# Altium schematic sheet LIDO-HW.100.InputStage_1.SchDoc
size A3; SheetNumber: 7; SheetTotal: 17
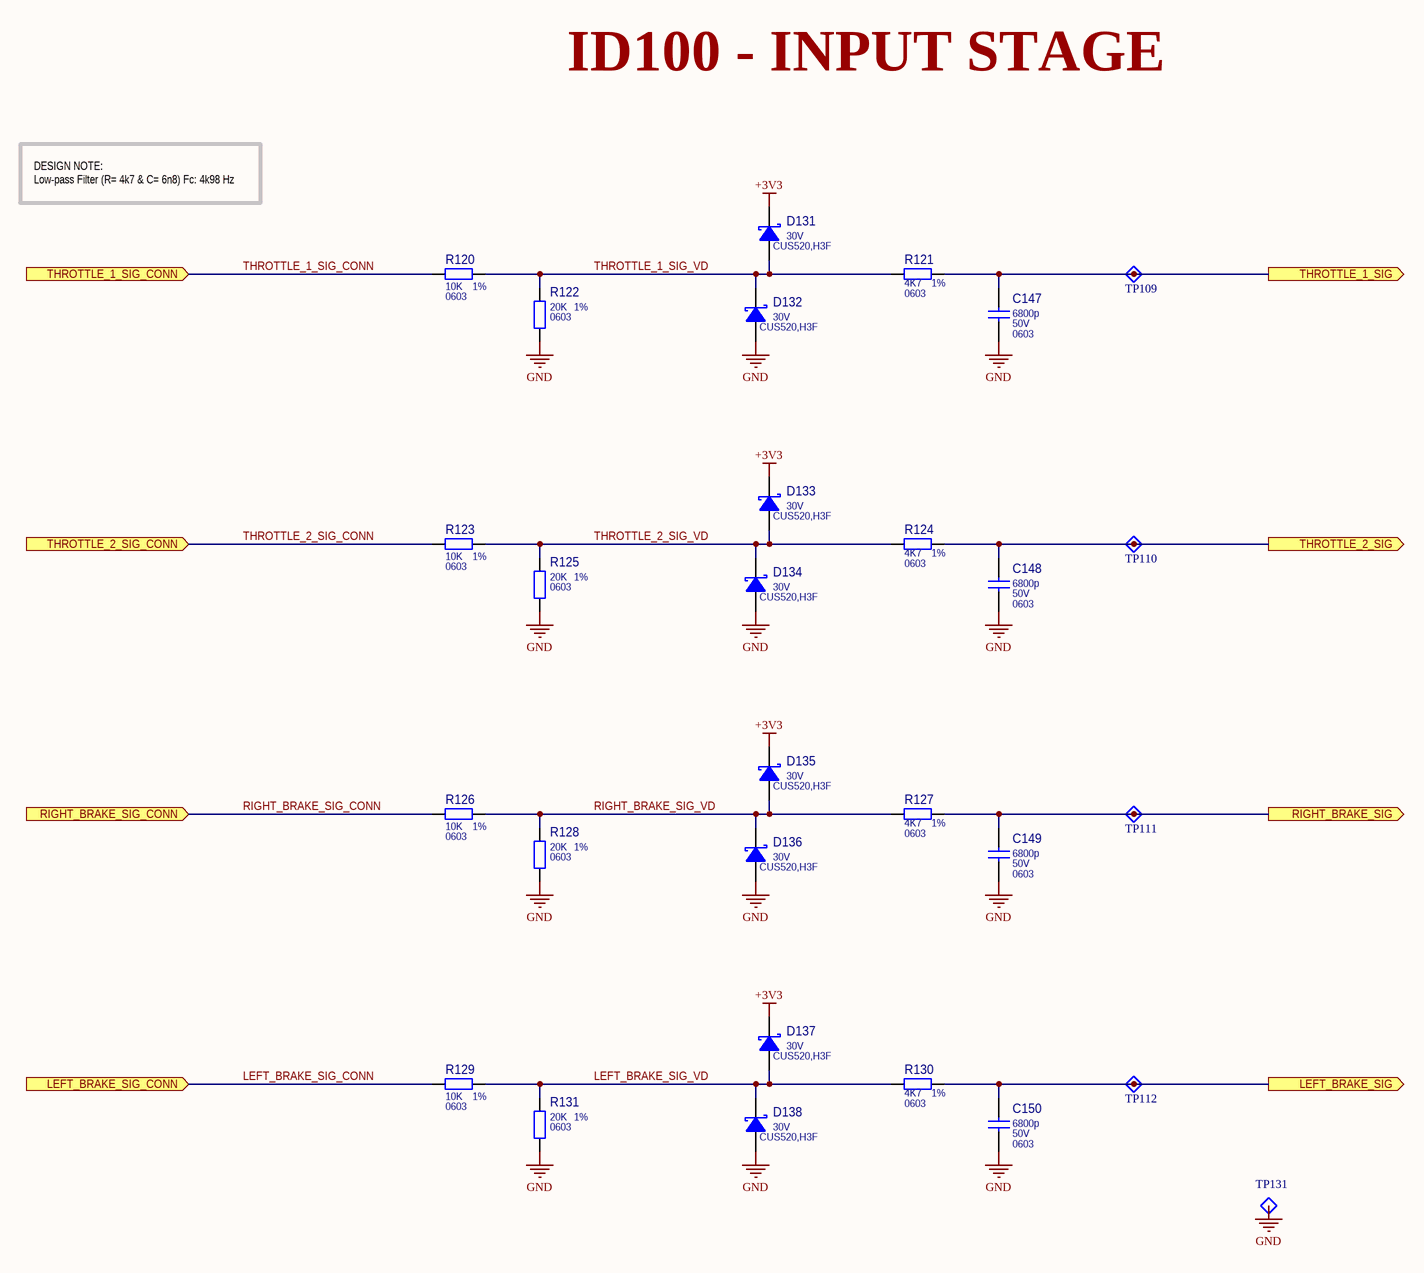
[diagram p0: LIDO-HW.100.InputStage_1.SchDoc]

## Parts
C147  6800p  Part Value 2: 50V  Part Package: 0603  [CAP_0603_1608X90-N_MURATA_A]
C148  6800p  Part Value 2: 50V  Part Package: 0603  [CAP_0603_1608X90-N_MURATA_A]
C149  6800p  Part Value 2: 50V  Part Package: 0603  [CAP_0603_1608X90-N_MURATA_A]
C150  6800p  Part Value 2: 50V  Part Package: 0603  [CAP_0603_1608X90-N_MURATA_A]
D131  30V  Manufacturer Part Number: CUS520,H3F  [NXP_SOD-323_250X125X95L30x32_A]
D132  30V  Manufacturer Part Number: CUS520,H3F  [NXP_SOD-323_250X125X95L30x32_A]
D133  30V  Manufacturer Part Number: CUS520,H3F  [NXP_SOD-323_250X125X95L30x32_A]
D134  30V  Manufacturer Part Number: CUS520,H3F  [NXP_SOD-323_250X125X95L30x32_A]
D135  30V  Manufacturer Part Number: CUS520,H3F  [NXP_SOD-323_250X125X95L30x32_A]
D136  30V  Manufacturer Part Number: CUS520,H3F  [NXP_SOD-323_250X125X95L30x32_A]
D137  30V  Manufacturer Part Number: CUS520,H3F  [NXP_SOD-323_250X125X95L30x32_A]
D138  30V  Manufacturer Part Number: CUS520,H3F  [NXP_SOD-323_250X125X95L30x32_A]
R120  10K  Part Value 2: 1%  Part Package: 0603  [RES_0603_1608X60-N_YAGEO_A]
R121  4K7  Part Value 2: 1%  Part Package: 0603  [RES_0603_1608X60-N_YAGEO_A]
R122  20K  Part Value 2: 1%  Part Package: 0603  [RES_0603_1608X60-N_YAGEO_A]
R123  10K  Part Value 2: 1%  Part Package: 0603  [RES_0603_1608X60-N_YAGEO_A]
R124  4K7  Part Value 2: 1%  Part Package: 0603  [RES_0603_1608X60-N_YAGEO_A]
R125  20K  Part Value 2: 1%  Part Package: 0603  [RES_0603_1608X60-N_YAGEO_A]
R126  10K  Part Value 2: 1%  Part Package: 0603  [RES_0603_1608X60-N_YAGEO_A]
R127  4K7  Part Value 2: 1%  Part Package: 0603  [RES_0603_1608X60-N_YAGEO_A]
R128  20K  Part Value 2: 1%  Part Package: 0603  [RES_0603_1608X60-N_YAGEO_A]
R129  10K  Part Value 2: 1%  Part Package: 0603  [RES_0603_1608X60-N_YAGEO_A]
R130  4K7  Part Value 2: 1%  Part Package: 0603  [RES_0603_1608X60-N_YAGEO_A]
R131  20K  Part Value 2: 1%  Part Package: 0603  [RES_0603_1608X60-N_YAGEO_A]
TP109  TestPoint_A  [TESTPOINT_1D_A]  (value not drawn)  (no BOM)
TP110  TestPoint_A  [TESTPOINT_1D_A]  (value not drawn)  (no BOM)
TP111  TestPoint_A  [TESTPOINT_1D_A]  (value not drawn)  (no BOM)
TP112  TestPoint_A  [TESTPOINT_1D_A]  (value not drawn)  (no BOM)
TP131  TestPoint_A  [TESTPOINT_1D_A]  (value not drawn)  (no BOM)

## Ports
LEFT_BRAKE_SIG (out), LEFT_BRAKE_SIG_CONN (in), RIGHT_BRAKE_SIG (out), RIGHT_BRAKE_SIG_CONN (in), THROTTLE_1_SIG (out), THROTTLE_1_SIG_CONN (in), THROTTLE_2_SIG (out), THROTTLE_2_SIG_CONN (in)

## Nets
+3V3: D131.C D133.C D135.C D137.C
GND: C147.2 C148.2 C149.2 C150.2 D132.A D134.A D136.A D138.A R122.1 R125.1 R128.1 R131.1 TP131.1(TP)
LEFT_BRAKE_SIG: C150.1 R130.2 TP112.1(TP) ; port LEFT_BRAKE_SIG
LEFT_BRAKE_SIG_CONN: R129.2 ; port LEFT_BRAKE_SIG_CONN
LEFT_BRAKE_SIG_VD: D137.A D138.C R129.1 R130.1 R131.2
RIGHT_BRAKE_SIG: C149.1 R127.2 TP111.1(TP) ; port RIGHT_BRAKE_SIG
RIGHT_BRAKE_SIG_CONN: R126.2 ; port RIGHT_BRAKE_SIG_CONN
RIGHT_BRAKE_SIG_VD: D135.A D136.C R126.1 R127.1 R128.2
THROTTLE_1_SIG: C147.1 R121.2 TP109.1(TP) ; port THROTTLE_1_SIG
THROTTLE_1_SIG_CONN: R120.2 ; port THROTTLE_1_SIG_CONN
THROTTLE_1_SIG_VD: D131.A D132.C R120.1 R121.1 R122.2
THROTTLE_2_SIG: C148.1 R124.2 TP110.1(TP) ; port THROTTLE_2_SIG
THROTTLE_2_SIG_CONN: R123.2 ; port THROTTLE_2_SIG_CONN
THROTTLE_2_SIG_VD: D133.A D134.C R123.1 R124.1 R125.2

## Notes on the sheet
- ID100 - INPUT STAGE
- DESIGN NOTE:
  Low-pass Filter (R= 4k7 & C= 6n8) Fc: 4k98 Hz
- Title:
- Size:
- Date:
- A3
- Sheet       of
- Engineer:
- Version:
- Part Number:
- Revision:
- Rev. date:
- Project:
- File:

## Library data of the parts
C147-C150 = 79: CAP CER 6800PF 50V X7R 0603; Manufacturer Part Number: CGA3E2X7R1H682K080AA; Manufacturer: TDK Corporation; Obsolete Part: False; Component ID: 79; Part Value: 6800p; Part Value 3: X7R; Package Type: SMT
D131-D138 = 17: DIODE SCHOTTKY 30V 200MA; Manufacturer: Toshiba Semiconductor and Storage; Part Package: SOD-323; Obsolete Part: False; Component ID: 17; Part Value: 30V; Part Value 2: 200mA; Package Type: SMT
R120 R123 R126 R129 = 115: RES 10K OHM 1% 1/10W 0603; Manufacturer Part Number: RC0603FR-0710KL; Manufacturer: YAGEO; Obsolete Part: False; Component ID: 115; Part Value: 10K; Part Value 3: 1/10W; Package Type: SMT
R121 R124 R127 R130 = 118: RES SMD 4.7K OHM 1% 1/10W 0603; Manufacturer Part Number: ERJ-3EKF4701V; Manufacturer: Panasonic Electronic Components; Obsolete Part: False; Component ID: 118; Part Value: 4K7; Part Value 3: 1/10W; Package Type: SMT
R122 R125 R128 R131 = 103: RES SMD 20K OHM 1% 1/10W 0603; Manufacturer Part Number: ERJ-3EKF2002V; Manufacturer: Panasonic Electronic Components; Manufacturer Part Number 2nd: RC0603FR-0720KL; Manufacturer 2nd: YAGEO; Obsolete Part: False; Component ID: 103; Part Value: 20K; Part Value 3: 1/10W; Package Type: SMT
TP109-TP112 TP131 = 3: Pad Diamater 1mm; Part: Test Point 1D A; Obsolete Part: False; 00_Name: TP_XXmm; Component ID: 3; 02_Layer: *; 01_Diameter: 1mm